# EAGLE design Grownetics Humidity and Temperature Sensor (EAGLE 7.2.0)
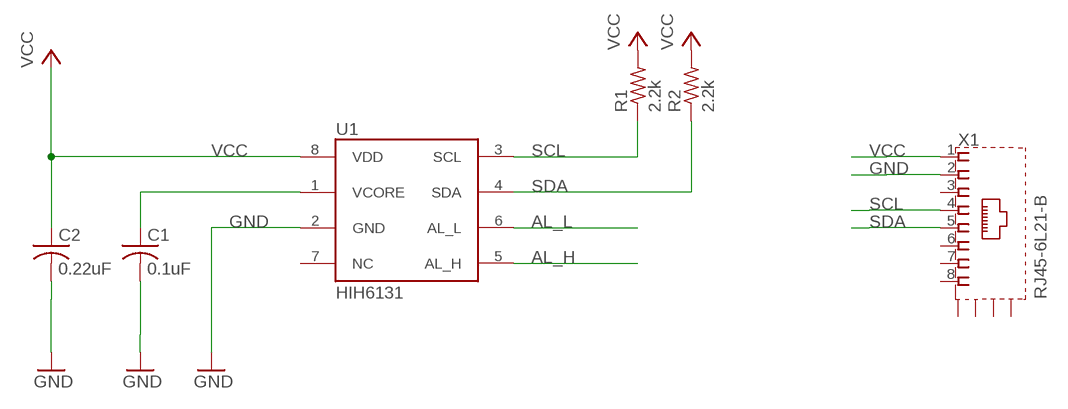
[diagram p0: schematic, sheet 1]

## Parts
C1  0.1uF  C-USC0805  [C0805]
C2  0.22uF  C-USC0805  [C0805]
R1  2.2k  R-US_R0805  [R0805]
R2  2.2k  R-US_R0805  [R0805]
U1  HIH6131  [SOIC8]
X1  RJ45-6L21-B  [RJ45-SHIELD1]

## Nets
AL_H: U1.5(AL_H)
AL_L: U1.6(AL_L)
GND: C1.2 C2.2 U1.2(GND) X1.2
SCL: R1.1 U1.3(SCL) X1.4
SDA: R2.1 U1.4(SDA) X1.5
VCC: C2.1 R1.2 R2.2 U1.8(VDD) X1.1
VCORE: C1.1 U1.1(VCORE)
Unconnected: U1.7(NC) X1.3 X1.6 X1.7 X1.8 X1.S1(S) X1.S2(S) X1.S3(S) X1.S4(S)

## Library data of the parts
C1 = resistor:C-US: CAPACITOR, American symbol; MPN: C0805S104K5RACAUTO; OC_NEWARK: 77Y7569
C2 = resistor:C-US: CAPACITOR, American symbol; MPN: C0805X224K5RACTU; OC_NEWARK: 76Y2994
R1 R2 = resistor:R-US_: RESISTOR, American symbol; MPN: SR1-0805-222; OC_NEWARK: 33C6600
U1 = SparkFun-AnalogIC:HIH6131; MPN: HIH6131-021-001; OC_NEWARK: 55T1170
X1 = con-tycoelectronics:RJ45*2: RJ45 Low Profile Shield Type 2 For all RJ45 L, LC, LCT and X Series Models Source: www.tycoelectronics.com .. ENG_DS_1654001_1099_RJ_L_0507.pdf; MPN: RJE71-188-1401; OC_FARNELL: unknown; OC_NEWARK: 47W2082

## Net classes
0 default: width 0.305 mm, drill 0.508 mm, clearance 0.254 mm

## Board
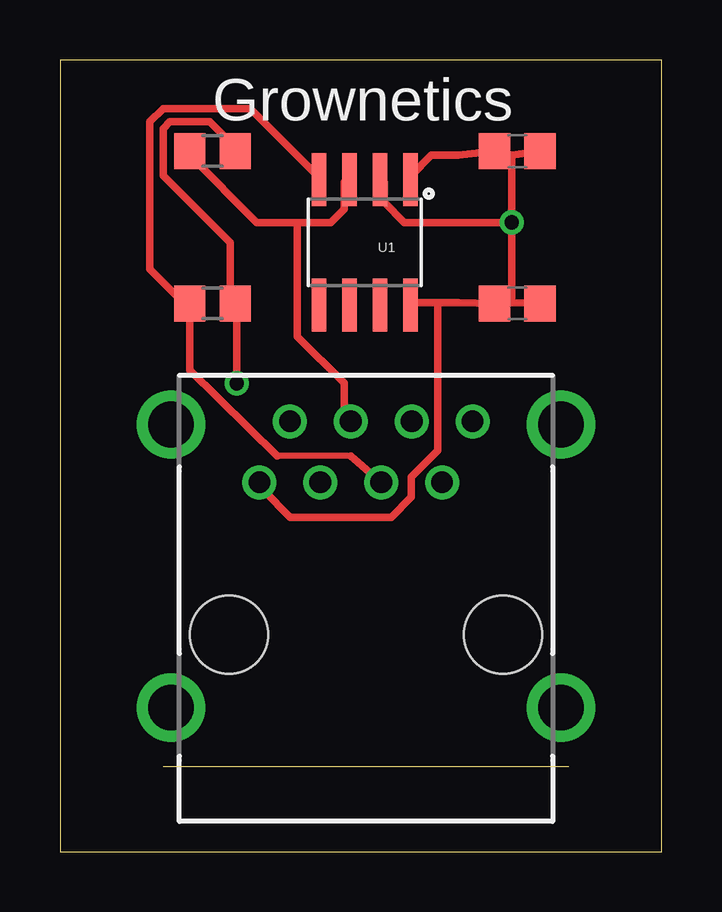
[diagram p1: board, top side]
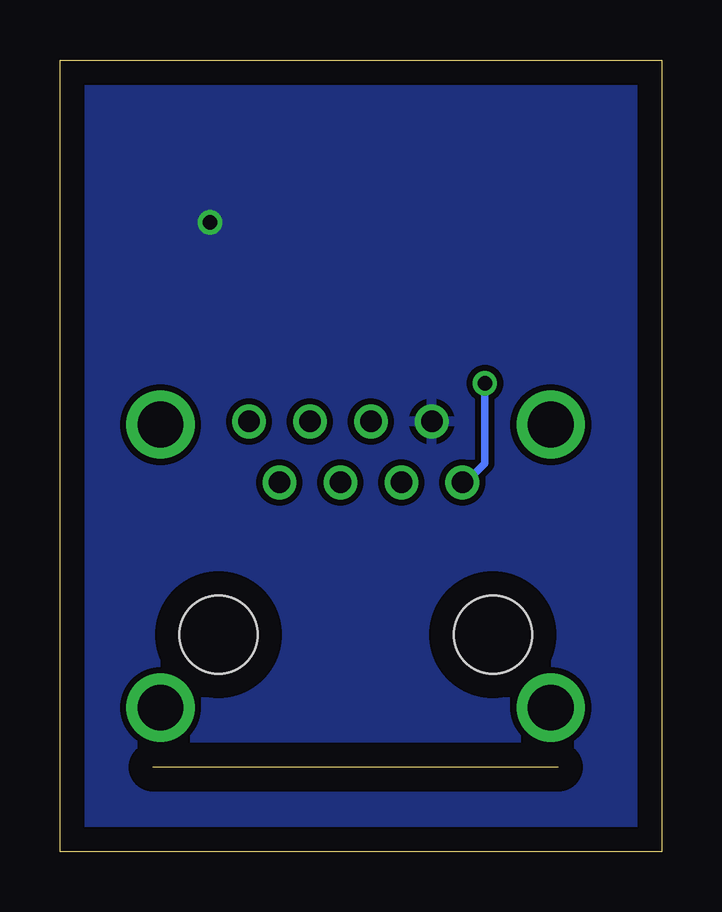
[diagram p2: board, bottom side, seen from below]

Size 25.07 x 33.01 mm. Coordinates in mm from the lower left corner, seen from the top.
Outline: 0,0 25.07,0 25.07,33.01 0,33.01 0,0
Copper layers (1*16): Top 0.035mm / dielectric 1.5mm / Bottom 0.035mm
Design rules "default": minimum track width 10mil, minimum drill 0.6mm, track to track 8mil, track to pad 8mil, pad to pad 8mil, via to via 8mil, smd to smd 8mil, copper to edge 40mil, drill to drill 8mil, minimum pad ring 10mil, minimum via ring 8mil, stop-mask expansion 4mil, vias tented up to drill 0mil, thermal gap 10mil

### Footprints (pad centres in the part's own frame; a part is rotated, then mirrored left to right if it is on the bottom)
C0805 = smd 1.3 x 1.5: 1 -0.95,0; 2 0.95,0
R0805 = smd 1.3 x 1.5: 1 -0.95,0; 2 0.95,0
SOIC8 = smd 0.61 x 2.21: 1 -1.905,-2.616; 2 -0.635,-2.616; 3 0.635,-2.616; 4 1.905,-2.616; 5 1.905,2.616; 6 0.635,2.616; 7 -0.635,2.616; 8 -1.905,2.616
RJ45-SHIELD1 = drill 0.9 pad 1.4: 1 -4.445,6.35; 2 -3.175,8.89; 3 -1.905,6.35; 4 -0.635,8.89; 5 0.635,6.35; 6 1.905,8.89; 7 3.175,6.35; 8 4.445,8.89 | drill 1.9 pad 2.5: S1 -8.128,-3.048; S2 8.128,-3.048; S3 -8.128,8.76; S4 8.128,8.76 | hole 3.251: -5.715,0; 5.715,0

### Placement (x,y rotation side)
C1  19.05,29.21 0 top
C2  19.05,22.86 0 top
R1  6.35,29.21 0 top
R2  6.35,22.86 0 top
U1  12.7,25.4 180 top
X1  12.75,9.05 0 top

### Tracks (layer width: path | path; a pad name or v marks a point on that pad's centre or on a via)
GND  (via drill 0.6)
  Top 0.305: v18.82,26.24 18.82,29.03 C1.2 | v18.82,26.24 18.82,22.88 C2.2 | v18.82,26.24 14.35,26.24 13.51,27.08 13.51,27.91 U1.2
  pour Bottom: -1.27,34.29 -1.27,-1.27 26.67,-1.27 26.67,34.29
SCL
  Top 0.305: 9.88,26.24 11.28,26.24 11.84,26.8 11.84,27.91 U1.3 | 9.88,26.24 8.2,26.24 5.41,29.03 R1.1 | 9.88,26.24 9.88,21.49 11.84,19.53 11.84,17.86 X1.4
SDA
  Top 0.254: 12.12,16.5 9.04,16.5
  Top 0.305: 9.04,16.5 5.41,20.09 5.41,22.61 R2.1 5.13,22.88 3.73,24.28 3.73,30.43 4.29,30.99 7.92,30.99 10.72,28.19 U1.4 | X1.5 12.12,16.5
VCC  (via drill 0.6)
  Top 0.305: R1.2 7.37,29.31 6.25,30.43 4.57,30.43 4.29,30.15 4.29,28.19 7.09,25.4 7.09,22.88 R2.2 7.37,22.61 v7.37,19.53 | 15.75,22.88 14.63,22.88 U1.8 | 15.75,22.88 16.59,22.88 C2.1 | 15.75,22.88 15.75,16.74 14.63,15.62 14.63,14.78 13.79,13.95 9.6,13.95 8.48,15.06 X1.1
  Bottom 0.305: v7.37,19.53 7.37,16.18 8.2,15.34 X1.1
VCORE
  Top 0.305: C1.1 16.59,29.03 15.47,29.03 14.63,28.19 U1.1

### Text on the board
tPlace: Grownetics